# Altium project R_BOARD.PrjPcb
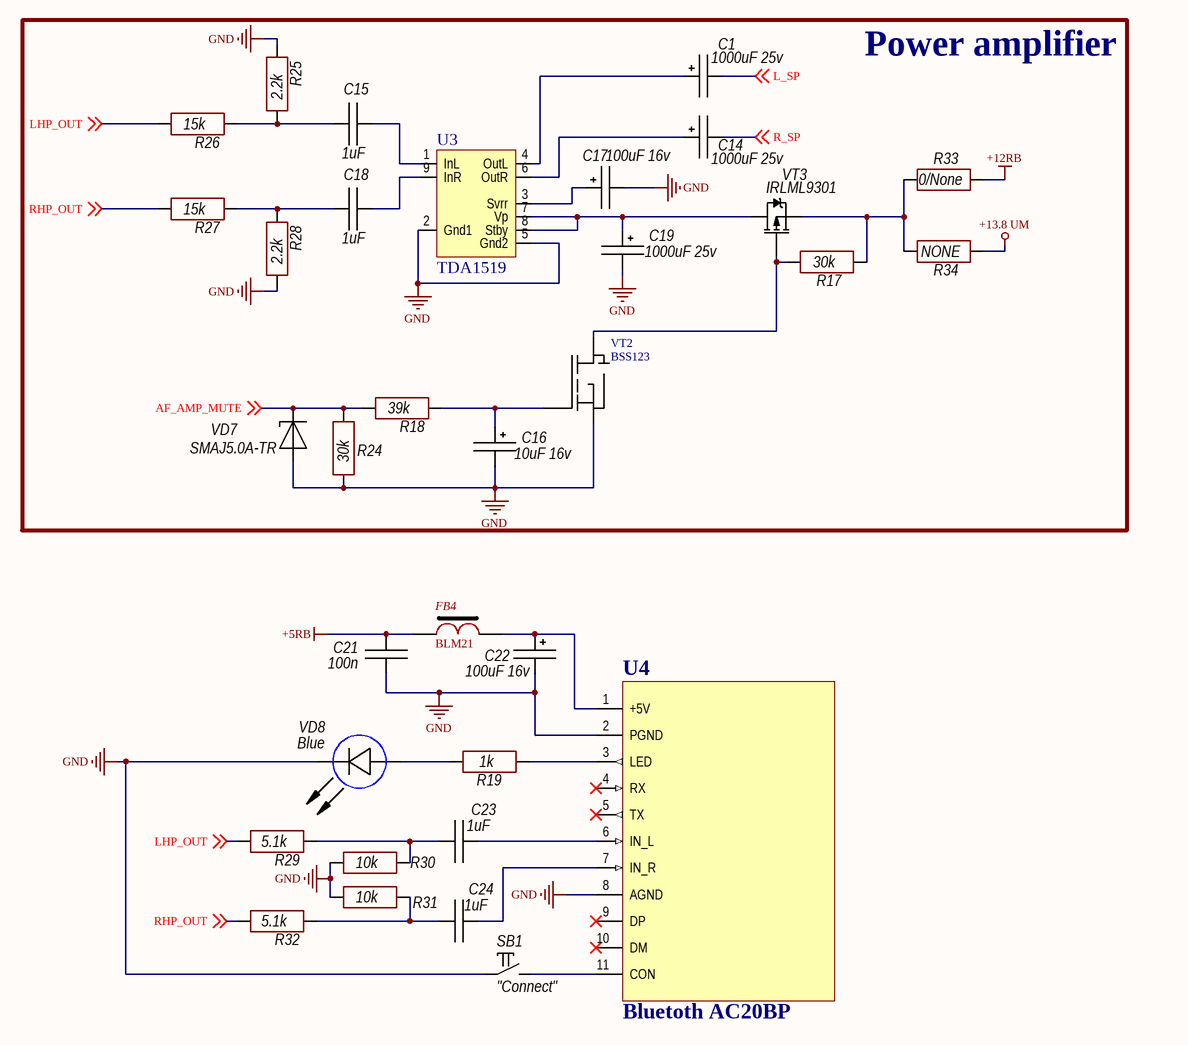
[diagram p0: RB_Audio.SchDoc]
1 sheet, 33 parts. Net scope: global (net labels, ports and power ports of the same name join across sheets).
Board file: RB_PCBv03.PcbDoc

## Sheet RB_Audio.SchDoc
size 420 x 297 mm; ApprovedBy: UA3REO; Author: RU4PN; CompanyName: Wolf 2; DocumentNumber: R_BOARD - Audio; SheetNumber: 3; SheetTotal: 3

### Parts
C1  1000uF 25v  [D10C5H12.5]
C14  1000uF 25v  [D10C5H12.5]
C15  1uF  [CH0805C]
C16  10uF 16v  [TANTAL_B]
C17  100uF 16v  [TANTAL_D]
C18  1uF  [CH0805C]
C19  1000uF 25v  [D10C5H12.5]
C21  100n  [CH0805C]
C22  100uF 16v  [D6.3C2.5H11]
C23  1uF  [CH0805C]
C24  1uF  [CH0805C]
FB4  BLM21  [CH0805L]
R17  30k  [CH0805R]
R18  39k  [CH0805R]
R19  1k  [CH0805R]
R24  30k  [CH0805R]
R25  2.2k  [CH0805R]
R26  15k  [CH0805R]
R27  15k  [CH0805R]
R28  2.2k  [CH0805R]
R29  5.1k  [CH0805R]
R30  10k  [CH0805R]
R31  10k  [CH0805R]
R32  5.1k  [CH0805R]
R33  0/None  [CH1206R]
R34  NONE  [CH1206R]
SB1  "Connect"  [BUT: 6x6 mm (R)]
U3  TDA1519  [SOT110B]
U4  Bluetoth AC20BP  [Bluetooth 11PIN]
VD7  SMAJ5.0A-TR  [SMA]
VD8  Blue  [CH0805LB]
VT2  BSS123  [SOT23_132]
VT3  IRLML9301  [SOT23_132]

### Blocks framed on the sheet
Power amplifier: C1 C14-C19 R17 R18 R24-R28 R33 R34 U3 VD7 VT2 VT3

### Nets
+5RB: C21.2 FB4.2
+12RB: R33.2
+13.8 UM: R34.2
GND: C16.2 C17.2 C19.2 C21.1 C22.2 R24.1 R25.2 R28.1 R30.1 R31.1 SB1.1 U3.2(Gnd1) U3.5(Gnd2) U4.2(PGND) U4.8(AGND) VD7.1(A) VD8.2(C) VT2.2(S)
AF_AMP_MUTE: R18.1 R24.2 VD7.2(C) ; off-sheet AF_AMP_MUTE
L_SP: C1.2 ; off-sheet L_SP
LHP_OUT: R26.1 R29.1 ; off-sheet LHP_OUT
R_SP: C14.2 ; off-sheet R_SP
RHP_OUT: R27.1 R32.1 ; off-sheet RHP_OUT
NetC1_1: C1.1 U3.4(OutL)
NetC14_1: C14.1 U3.6(OutR)
NetC15_1: C15.1 R25.1 R26.2
NetC15_2: C15.2 U3.1(InL)
NetC16_1: C16.1 R18.2 VT2.1(G)
NetC17_1: C17.1 U3.3(Svrr)
NetC18_1: C18.1 R27.2 R28.2
NetC18_2: C18.2 U3.9(InR)
NetC19_1: C19.1 U3.7(Vp) U3.8(Stby) VT3.3(D)
NetC22_1: C22.1 FB4.1 U4.1(+5V)
NetC23_1: C23.1 R29.2 R30.2
NetC23_2: C23.2 U4.6(IN_L)
NetC24_1: C24.1 R31.2 R32.2
NetC24_2: C24.2 U4.7(IN_R)
NetR17_1: R17.1 VT2.3(D) VT3.1(G)
NetR17_2: R17.2 R33.1 R34.1 VT3.2(S)
NetR19_1: R19.1 VD8.1(A)
NetR19_2: R19.2 U4.3(LED)
NetSB1_2: SB1.2 U4.11(CON)

Not connected (* = marked no-connect by the designer): U4 4(RX)* 5(TX)* 9(DP)* 10(DM)*

### Notes on the sheet
- Перв. примен.
- Справ. №
- Подп. и дата
- Инв. № дубл.
- Взам. инв. №
- Разраб.
- Изм.
- Лист
- № докум.
- Подп.
- Дата
- Лит.
- Масса
- Масштаб
- Пров.
- Т.контр.
- Листов
- Инв. № подл.
- Утв.
- Н.контр.
- 2.106-A3
- Копировал
- Формат А3

### Library data of the parts
C1 C14 C19 C22 = AlumCap: Manufacturer: *; Model: *; HelpURL: *; ComponentKind: *; Value: *
C15 C18 C21 C23 C24 = Capacitor: Manufacturer: *; Model: *; HelpURL: *; ComponentKind: *; Value: *
C16 C17 = TantalCap: Manufacturer: *; Model: *; HelpURL: *; ComponentKind: *; Value: *
FB4 = FB-1
R17-R19 R24-R34 = Resistor: Manufacturer: *; Model: *; HelpURL: *; ComponentKind: *; Value: *
SB1 = Tactile switches: 6x6 mm; Manufacturer: *; Model: *; HelpURL: *; ComponentKind: *
U4 = Bluetoth AC20BP Module
VD7 = Diod Zener: ComponentKind: *; Manufacturer: *; Model: *; HelpURL: *
VD8 = LED: Manufacturer: *; Model: *; HelpURL: *; ComponentKind: *; Value: *
VT3 = IRLML9301: Mosfet; Model: *; Manufacturer: *; ComponentKind: *; HelpURL: *